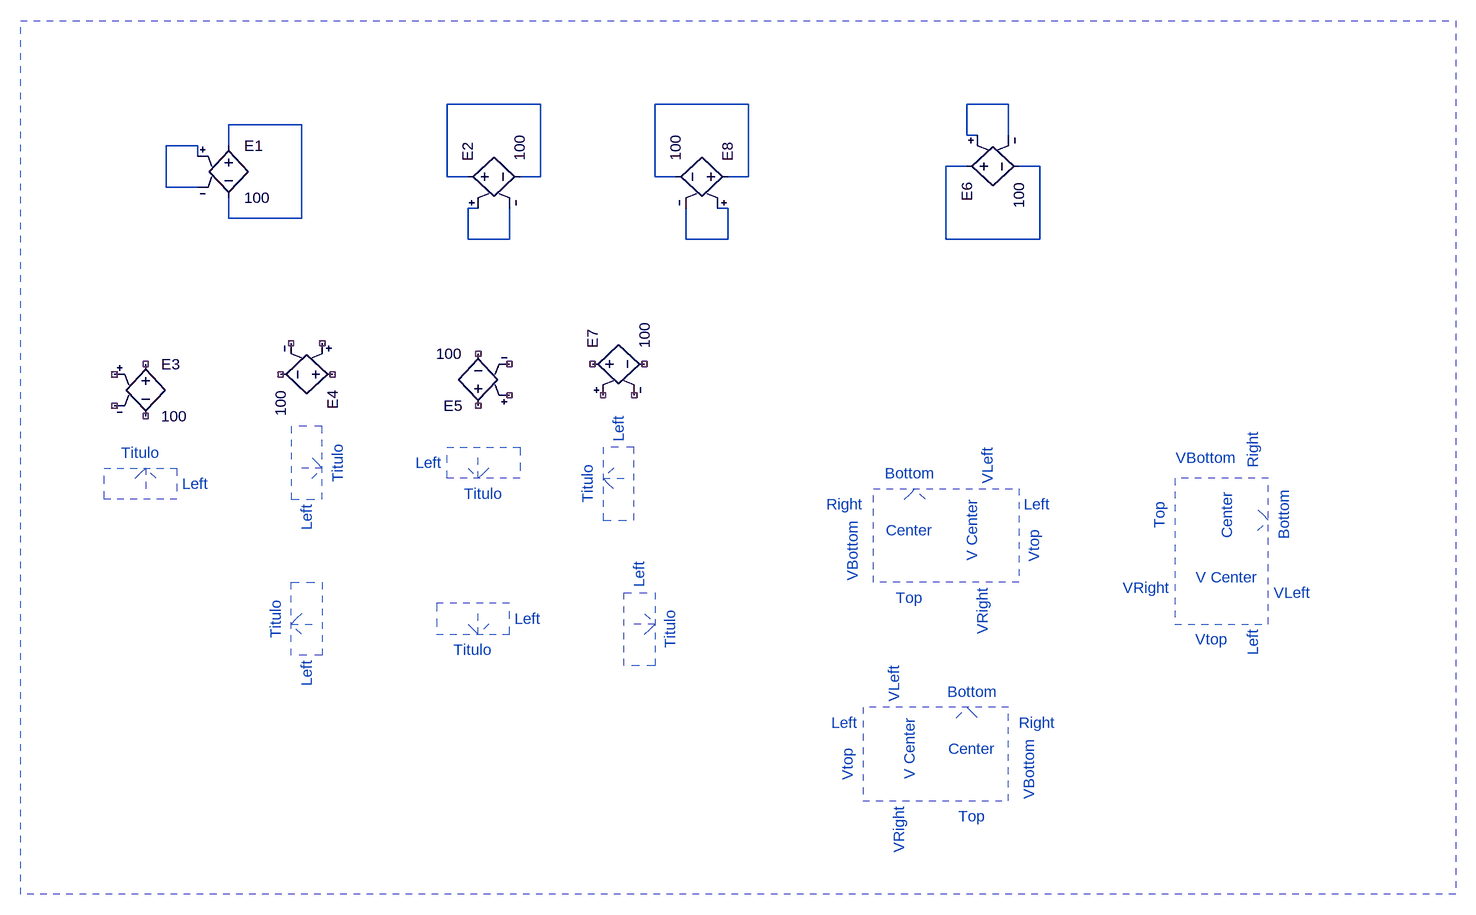
[diagram p0: schematic 07- Orientation Mirror Bug.asc]
07- Orientation Mirror Bug.asc, the LTspice schematic file:
Version 4.1
SHEET 1 2036 3832
WIRE 624 1008 480 1008
WIRE 944 1008 800 1008
WIRE 1344 1008 1280 1008
WIRE 256 1040 144 1040
WIRE 1280 1056 1280 1008
WIRE 1296 1056 1280 1056
WIRE 1344 1056 1344 1008
WIRE 96 1072 48 1072
WIRE 144 1072 144 1040
WIRE 96 1088 96 1072
WIRE 1280 1104 1248 1104
WIRE 1392 1104 1360 1104
WIRE 480 1120 480 1008
WIRE 512 1120 480 1120
WIRE 624 1120 624 1008
WIRE 624 1120 592 1120
WIRE 800 1120 800 1008
WIRE 832 1120 800 1120
WIRE 944 1120 944 1008
WIRE 944 1120 912 1120
WIRE 48 1136 48 1072
WIRE 96 1136 48 1136
WIRE 528 1168 512 1168
WIRE 912 1168 896 1168
WIRE 144 1184 144 1152
WIRE 256 1184 256 1040
WIRE 256 1184 144 1184
WIRE 512 1216 512 1168
WIRE 576 1216 576 1168
WIRE 576 1216 512 1216
WIRE 848 1216 848 1168
WIRE 912 1216 912 1168
WIRE 912 1216 848 1216
WIRE 1248 1216 1248 1104
WIRE 1392 1216 1392 1104
WIRE 1392 1216 1248 1216
SYMBOL e 1264 1104 M90
SYMATTR InstName E6
SYMATTR Value 100
SYMBOL e 928 1120 M270
SYMATTR InstName E8
SYMATTR Value 100
SYMBOL e 144 1056 R0
SYMATTR InstName E1
SYMATTR Value 100
SYMBOL e 496 1120 R270
SYMATTR InstName E2
SYMATTR Value 100
SYMBOL e 16 1392 R0
SYMATTR InstName E3
SYMATTR Value 100
SYMBOL e 320 1424 R90
SYMATTR InstName E4
SYMATTR Value 100
SYMBOL e 528 1488 R180
SYMATTR InstName E5
SYMATTR Value 100
SYMBOL e 688 1408 R270
SYMATTR InstName E7
SYMATTR Value 100
TEXT 8 1560 Bottom 2 ;Titulo
TEXT 72 1592 Left 2 ;Left
TEXT 296 1560 VTop 2 ;Titulo
TEXT 264 1624 VRight 2 ;Left
TEXT 536 1592 Top 2 ;Titulo
TEXT 472 1560 Right 2 ;Left
TEXT 712 1592 VBottom 2 ;Titulo
TEXT 744 1528 VLeft 2 ;Left
TEXT 232 1800 VBottom 2 ;Titulo
TEXT 264 1864 VRight 2 ;Left
TEXT 520 1832 Top 2 ;Titulo
TEXT 584 1800 Left 2 ;Left
TEXT 808 1816 VTop 2 ;Titulo
TEXT 776 1752 VLeft 2 ;Left
TEXT 1192 1592 Bottom 2 ;Bottom
TEXT 1368 1624 Left 2 ;Left
TEXT 1120 1624 Right 2 ;Right
TEXT 1192 1752 Top 2 ;Top
TEXT 1288 1664 VCenter 2 ;V Center
TEXT 1120 1696 VBottom 2 ;VBottom
TEXT 1368 1688 VTop 2 ;Vtop
TEXT 1312 1592 VLeft 2 ;VLeft
TEXT 1304 1752 VRight 2 ;VRight
TEXT 1192 1664 Center 2 ;Center
TEXT 1752 1640 VTop 2 ;Bottom
TEXT 1720 1816 VRight 2 ;Left
TEXT 1720 1568 VLeft 2 ;Right
TEXT 1592 1640 VBottom 2 ;Top
TEXT 1680 1736 Center 2 ;V Center
TEXT 1648 1568 Bottom 2 ;VBottom
TEXT 1656 1816 Top 2 ;Vtop
TEXT 1752 1760 Left 2 ;VLeft
TEXT 1592 1752 Right 2 ;VRight
TEXT 1680 1640 VCenter 2 ;Center
TEXT 1288 1928 Bottom 2 ;Bottom
TEXT 1112 1960 Right 2 ;Left
TEXT 1360 1960 Left 2 ;Right
TEXT 1288 2088 Top 2 ;Top
TEXT 1192 2000 VCenter 2 ;V Center
TEXT 1360 2032 VTop 2 ;VBottom
TEXT 1112 2024 VBottom 2 ;Vtop
TEXT 1168 1928 VLeft 2 ;VLeft
TEXT 1176 2088 VRight 2 ;VRight
TEXT 1288 2000 Center 2 ;Center
LINE Normal 16 1568 16 1600 2
LINE Normal 0 1584 16 1568 2
LINE Normal 16 1568 0 1584 2
LINE Normal 32 1584 16 1568 2
LINE Normal 288 1568 256 1568 2
LINE Normal 272 1552 288 1568 2
LINE Normal 288 1568 272 1552 2
LINE Normal 272 1584 288 1568 2
LINE Normal 528 1584 528 1552 2
LINE Normal 544 1568 528 1584 2
LINE Normal 528 1584 544 1568 2
LINE Normal 512 1568 528 1584 2
LINE Normal 720 1584 752 1584 2
LINE Normal 736 1600 720 1584 2
LINE Normal 720 1584 736 1600 2
LINE Normal 736 1568 720 1584 2
LINE Normal 240 1808 272 1808 2
LINE Normal 256 1792 240 1808 2
LINE Normal 240 1808 256 1792 2
LINE Normal 256 1824 240 1808 2
LINE Normal 528 1824 528 1792 2
LINE Normal 512 1808 528 1824 2
LINE Normal 528 1824 512 1808 2
LINE Normal 544 1808 528 1824 2
LINE Normal 800 1808 768 1808 2
LINE Normal 784 1824 800 1808 2
LINE Normal 800 1808 784 1824 2
LINE Normal 784 1792 800 1808 2
LINE Normal 1184 1616 1200 1600 2
LINE Normal 1200 1600 1184 1616 2
LINE Normal 1216 1616 1200 1600 2
LINE Normal 1728 1632 1744 1648 2
LINE Normal 1744 1648 1728 1632 2
LINE Normal 1728 1664 1744 1648 2
LINE Normal 1296 1952 1280 1936 2
LINE Normal 1280 1936 1296 1952 2
LINE Normal 1264 1952 1280 1936 2
RECTANGLE Normal 2032 2224 -176 880 2
RECTANGLE Normal 64 1616 -48 1568 2
RECTANGLE Normal 240 1616 288 1504 2
RECTANGLE Normal 480 1536 592 1584 2
RECTANGLE Normal 768 1536 720 1648 2
RECTANGLE Normal 288 1856 240 1744 2
RECTANGLE Normal 576 1776 464 1824 2
RECTANGLE Normal 752 1760 800 1872 2
RECTANGLE Normal 1360 1744 1136 1600 2
RECTANGLE Normal 1600 1808 1744 1584 2
RECTANGLE Normal 1120 2080 1344 1936 2

The netlist it stands for:
* 07- Orientation Mirror Bug.asc
E6 N006 N006 N003 N003 100
E8 N002 N002 N008 N008 100
E1 N004 N004 N005 N005 100
E2 N001 N001 N007 N007 100
E3 NC_01 NC_02 NC_03 NC_04 100
E4 NC_05 NC_06 NC_07 NC_08 100
E5 NC_09 NC_10 NC_11 NC_12 100
E7 NC_13 NC_14 NC_15 NC_16 100
* Titulo
* Left
* Titulo
* Left
* Titulo
* Left
* Titulo
* Left
* Titulo
* Left
* Titulo
* Left
* Titulo
* Left
* Bottom
* Left
* Right
* Top
* V Center
* VBottom
* Vtop
* VLeft
* VRight
* Center
* Bottom
* Left
* Right
* Top
* V Center
* VBottom
* Vtop
* VLeft
* VRight
* Center
* Bottom
* Left
* Right
* Top
* V Center
* VBottom
* Vtop
* VLeft
* VRight
* Center
.backanno
.end